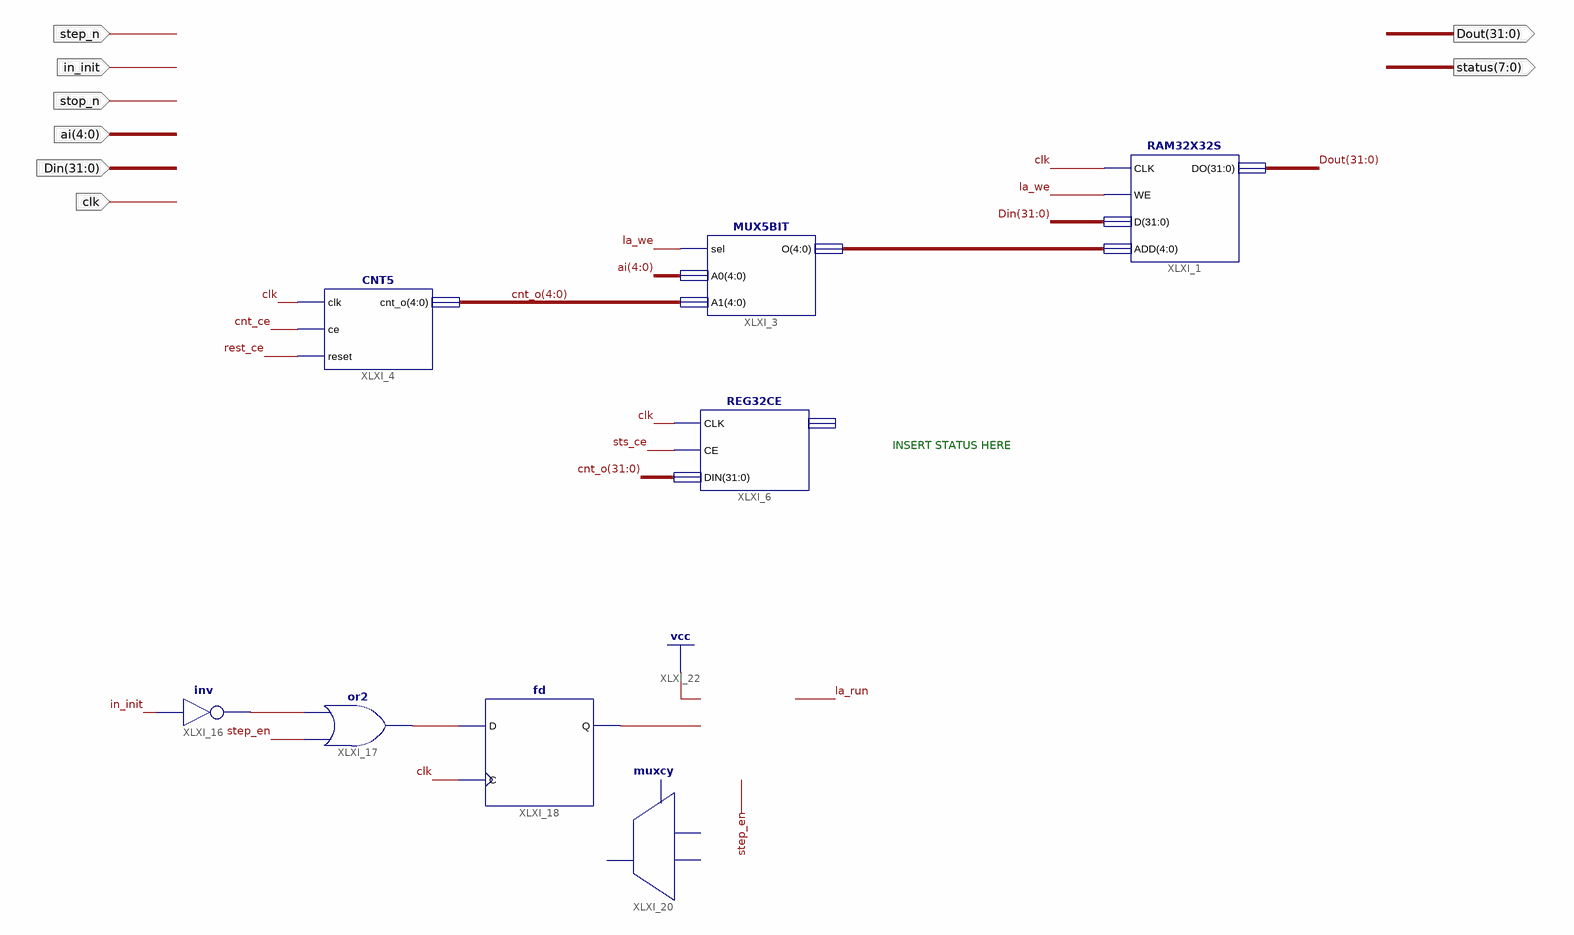
[diagram p0: schematic sheet 1]
// Xilinx ISE schematic model_monitor.sch (spartan6) as structural Verilog: 8 symbols, 8 ports
module model_monitor (
  input  step_n,
  input  in_init,
  input  stop_n,
  input  [4:0] ai,
  input  clk,
  input  [31:0] Din,
  output [31:0] Dout,
  output [7:0] status
);

  wire cnt_ce, la_run, la_we, rest_ce, step_en, sts_ce, XLXN_75, XLXN_78, XLXN_82;
  wire [4:0] XLXN_17;
  wire [31:0] cnt_o;

  MUX5BIT XLXI_3 (.sel(la_we), .A0(ai), .A1(cnt_o[4:0]), .O(XLXN_17));
  CNT5 XLXI_4 (.clk(clk), .ce(cnt_ce), .reset(rest_ce), .cnt_o(cnt_o[4:0]));
  REG32CE XLXI_6 (.CLK(clk), .CE(sts_ce), .DIN(cnt_o));  // open: DOUT
  RAM32X32S XLXI_1 (.CLK(clk), .WE(la_we), .D(Din), .ADD(XLXN_17), .DO(Dout));
  not XLXI_16 (XLXN_75, in_init);
  or XLXI_17 (XLXN_82, step_en, XLXN_75);
  fd XLXI_18 (.C(clk), .D(XLXN_82), .Q(XLXN_78));
  muxcy XLXI_20 (.CI(1'b1), .DI(XLXN_78), .S(step_en), .O(la_run));

  // Notes on the sheet:
  //   INSERT STATUS HERE
endmodule
